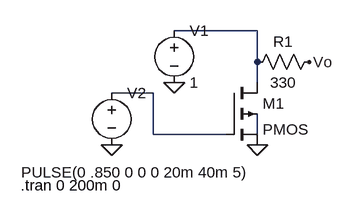
[diagram p0: schematic transistor_plain_setup.asc]
transistor_plain_setup.asc, the LTspice schematic file:
Version 4
SHEET 1 880 680
WIRE 224 32 96 32
WIRE 224 80 224 32
WIRE 224 112 224 80
WIRE 64 128 0 128
WIRE 64 192 64 128
WIRE 176 192 64 192
WIRE 224 192 224 160
FLAG 96 112 0
FLAG 0 208 0
FLAG 224 208 0
FLAG 304 80 Vo
SYMBOL pmos4 176 112 R0
SYMATTR InstName M1
SYMBOL voltage 96 16 R0
WINDOW 123 0 0 Left 0
WINDOW 39 0 0 Left 0
SYMATTR InstName V1
SYMATTR Value 1
SYMBOL voltage 0 112 R0
WINDOW 3 -139 138 Left 2
WINDOW 123 0 0 Left 0
WINDOW 39 0 0 Left 0
SYMATTR InstName V2
SYMATTR Value PULSE(0 .850 0 0 0 20m 40m 5)
SYMBOL res 320 64 R90
WINDOW 0 0 56 VBottom 2
WINDOW 3 32 56 VTop 2
SYMATTR InstName R1
SYMATTR Value 330
TEXT -140 270 Left 2 !.tran 0 200m 0

The netlist it stands for:
* transistor_plain_setup.asc
M1 N001 N002 0 N003 PMOS
V1 N001 0 1
V2 N002 0 PULSE(0 .850 0 0 0 20m 40m 5)
R1 Vo N001 330
.model NMOS NMOS
.model PMOS PMOS
.lib standard.mos
.tran 0 200m 0
.backanno
.end